# Altium project PCB_Project.PrjPcb
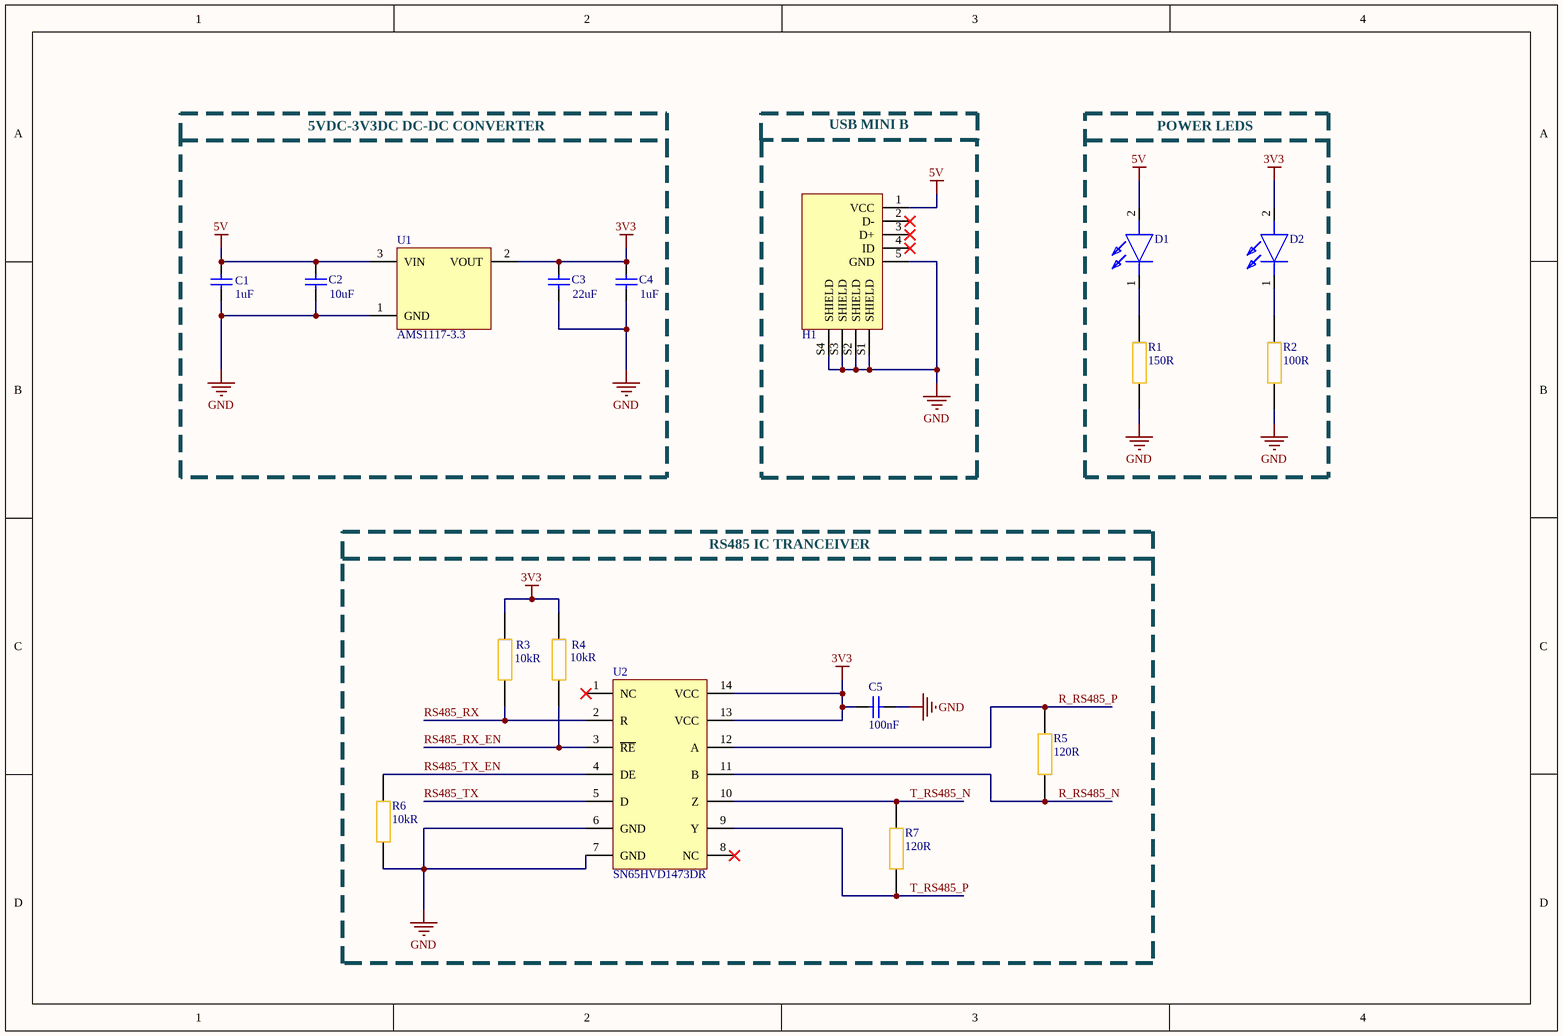
[diagram p0: PowerManagement.SchDoc]
3 sheets, 46 parts. Net scope: global (net labels, ports and power ports of the same name join across sheets).
Board file: PCB_STM.PcbDoc
Sheets:
  PowerManagement.SchDoc
  Microcontroller.SchDoc
  Connectors.SchDoc

## Sheet PowerManagement.SchDoc
size A4; SheetNumber: 1; SheetTotal: 3

### Parts
C1  1uF  [WCAP-CSGP_0603_L1.6W0.8H0.8_Reflow]
C2  10uF  [WCAP-CSGP_0603_L1.6W0.8H0.8_Reflow]
C3  22uF  [WCAP-CSGP_0805_L2W1.25H1.25]
C4  1uF  [WCAP-CSGP_0603_L1.6W0.8H0.8_Reflow]
C5  100nF  [WCAP-CSGP_0603_L1.6W0.8H0.8_Reflow]
D1  APT1608SGC  [LED GREEN]  (value not drawn)
D2  APT1608SGC  [LED GREEN]  (value not drawn)
H1  690-005-299-043  [USB]  (value not drawn)
R1  Resistance: 150R  [RES 0603]  (hidden comment: RC0603FR-07150RL)
R2  Resistance: 100R  [RES 0603]  (hidden comment: RC0603FR-13100RL)
R3  Resistance: 10kR  [RES 0603]  (hidden comment: RC0603FR-0710KP)
R4  Resistance: 10kR  [RES 0603]  (hidden comment: RC0603FR-0710KP)
R5  Resistance: 120R  [RES 0603]  (hidden comment: RC0603FR-07120RL)
R6  Resistance: 10kR  [RES 0603]  (hidden comment: RC0603FR-0710KP)
R7  Resistance: 120R  [RES 0603]  (hidden comment: RC0603FR-07120RL)
U1  AMS1117-3.3  [SOT-223]
U2  SN65HVD1473DR  [14-SOIC]

### Blocks framed on the sheet
5VDC-3V3DC DC-DC CONVERTER: C1-C4 U1
USB MINI B: H1
RS485 IC TRANCEIVER: C5 R3-R7 U2

### Nets
3V3: C3.2 C4.2 C5.2 D2.2(A) R3.2 R4.2 U1.2(VOUT) U2.13(VCC) U2.14(VCC)
5V: C1.2 C2.2 D1.2(A) H1.1(VCC) U1.3(VIN)
GND: C1.1 C2.1 C3.1 C4.1 C5.1 H1.5(GND) H1.S1(SHIELD) H1.S2(SHIELD) H1.S3(SHIELD) H1.S4(SHIELD) R1.1 R2.1 R6.2 U1.1(GND) U2.6(GND) U2.7(GND)
R_RS485_N: R5.2 U2.11(B)
R_RS485_P: R5.1 U2.12(A)
RS485_RX: R3.1 U2.2(R)
RS485_RX_EN: R4.1 U2.3(~{RE})
RS485_TX: U2.5(D)
RS485_TX_EN: R6.1 U2.4(DE)
T_RS485_N: R7.2 U2.10(Z)
T_RS485_P: R7.1 U2.9(Y)
NetD1_1: D1.1(K) R1.2
NetD2_1: D2.1(K) R2.2

Not connected (* = marked no-connect by the designer): H1 2(D-)* 3(D+)* 4(ID)*; U2 1(NC)* 8(NC)*

### Notes on the sheet
- POWER LEDS

### Library data of the parts
C1 C4 = 885012106010: WCAP-CSGP Multilayer Ceramic Chip Capacitor, General Purpose, size 0603, X5R, 1µF, 10VDC; Manufacturer: Wurth Elektronik; Case/Size Code: 0603; Capacitance Tolerance: +/-20%; Dissipation Factor: 10%; Insulation Resistance: 0.1GOhm; Rated Voltage (DC): 10V; Technical Reference: X5R0603105M010DFCT10000; Manufacturer Part Number: 885012106010; Category: Multilayer Ceramic Chip Capacitors; Match Code: WCAP-CSGP; ComponentLink1Description: Website Link; ComponentLink1URL: https://www.we-online.com/redexpert/article/885012106010?ad; ComponentLink2Description: Datasheet Link; ComponentLink2URL: https://www.we-online.com/redexpert/spec/885012106010?ad; Mount: Surface Mount; Operating Temperature Max: 85°C; Operating Temperature Min: -55°C; Packaging: Tape and Reel; Length: 1.6mm; Width: 0.8mm; Height: 0.8mm; Capacitance: 1uF; Ceramic Type: X5R
C2 = 885012106031: WCAP-CSGP Multilayer Ceramic Chip Capacitor, General Purpose, size 0603, X5R, 10µF, 25VDC; Manufacturer: Wurth Elektronik; Case/Size Code: 0603; Capacitance Tolerance: +/20%; Dissipation Factor: 20%; Insulation Resistance: 0.01GOhm; Rated Voltage (DC): 25V; Technical Reference: X5R0603106M025DFCT10000; Manufacturer Part Number: 885012106031; Category: Multilayer Ceramic Chip Capacitors; Match Code: WCAP-CSGP; ComponentLink1Description: Website Link; ComponentLink1URL: https://www.we-online.com/redexpert/article/885012106031?ad; ComponentLink2Description: Datasheet Link; ComponentLink2URL: https://www.we-online.com/redexpert/spec/885012106031?ad; Mount: Surface Mount; Operating Temperature Max: 85°C; Operating Temperature Min: -55°C; Packaging: Tape and Reel; Length: 1.6mm; Width: 0.8mm; Height: 0.8mm; Capacitance: 10uF; Ceramic Type: X5R
C3 = 885012107011: WCAP-CSGP Multilayer Ceramic Chip Capacitor, General Purpose, size 0805, X5R, 22µF, 10VDC; Manufacturer: Wurth Elektronik; Case/Size Code: 0805; Capacitance Tolerance: +/-20%; Dissipation Factor: 10%; Insulation Resistance: 0.005GOhm; Rated Voltage (DC): 10V; Technical Reference: X5R0805226M010DFCT10000; Manufacturer Part Number: 885012107011; Category: Multilayer Ceramic Chip Capacitors; Match Code: WCAP-CSGP; ComponentLink1Description: Website Link; ComponentLink1URL: https://www.we-online.com/redexpert/article/885012107011?ad; ComponentLink2Description: Datasheet Link; ComponentLink2URL: https://www.we-online.com/redexpert/spec/885012107011?ad; Mount: Surface Mount; Operating Temperature Max: 85°C; Operating Temperature Min: -55°C; Packaging: Tape and Reel; Length: 2mm; Width: 1.25mm; Height: 1.25mm; Capacitance: 22uF; Ceramic Type: X5R
C5 = 885012206046: WCAP-CSGP Multilayer Ceramic Chip Capacitor, General Purpose, size 0603, X7R, 100nF, 16VDC; Manufacturer: Wurth Elektronik; Case/Size Code: 0603; Capacitance Tolerance: +/-10%; Dissipation Factor: 3.5%; Insulation Resistance: 5GOhm; Rated Voltage (DC): 16V; Technical Reference: X7R0603104K016DFCT10000; Manufacturer Part Number: 885012206046; Category: Multilayer Ceramic Chip Capacitors; Match Code: WCAP-CSGP; ComponentLink1Description: Website Link; ComponentLink1URL: https://www.we-online.com/redexpert/article/885012206046?ad; ComponentLink2Description: Datasheet Link; ComponentLink2URL: https://www.we-online.com/redexpert/spec/885012206046?ad; Mount: Surface Mount; Operating Temperature Max: 125°C; Operating Temperature Min: -55°C; Packaging: Tape and Reel; Length: 1.6mm; Width: 0.8mm; Height: 0.8mm; Capacitance: 100nF; Ceramic Type: X7R
D1 D2 = APT1608SGC: LED GREEN CLEAR 0603 SMD; Manufacturer: Kingbright; Forward Voltage: 2.2V; Viewing Angle: 120°; Forward Current: 20mA; Luminous Intensity: 15mcd; Lens Style: Clear,Flat; Dominant Wavelength: 568nm; Number of LEDs: 1; Designed by: ADAK; Supplier 1: Digi-Key; Manufacturer Part Number: APT1608SGC; RoHS: Yes; Category: LEDs; Stock 1: 356278; Pricing 1: 1=0,3, 10=0,237, 100=0,1064, 500=0,0961, 1000=0,07894 (USD); Mount: Surface Mount; Case/Package: 0603; Number of Pins: 2; Color: Green; Case Code (Metric): 1608; Case Code (Imperial): 0603; Lens Color: Clear; Min Operating Temperature: -40°C; Max Operating Temperature: 85°C; Package Quantity: 2000; Illumination Color: Green; Packaging: Tape and Reel; Test Current: 20mA; Wavelength: 568nm; Series: APT; Length: 1.6mm; Width: 0.8mm; Height: 0.75mm; Lead Free: Lead Free; RoHS Compliant: Yes; ComponentLink1URL: https://datasheet.ciiva.com/12400/apt1608sgc-32861-12400932.pdf?src-supplier=Mouser; ComponentLink1Description: https://datasheet.ciiva.com/12400/apt1608sgc-32861-12400932.pdf?src-supplier=Mouser; ComponentLink2URL: https://datasheet.ciiva.com/2113/apt1608sgc-2113808.pdf?src-supplier=Digi-Key; ComponentLink2Description: https://datasheet.ciiva.com/2113/apt1608sgc-2113808.pdf?src-supplier=Digi-Key; ComponentLink3URL: https://datasheet.ciiva.com/14603/70062839-14603927.pdf?src-supplier=Allied+Electronics; ComponentLink3Description: https://datasheet.ciiva.com/14603/70062839-14603927.pdf?src-supplier=Allied+Electronics; Supplier Part Number 1: 754-1121-1-ND
H1 = USB Mini B: CONN RCPT USB2.0 MINI B SMD R/A; Manufacturer: EDAC; Number of Contacts: 5; Gender: Receptacle; Number of Ports: 1; Mating Cycles: 1500; Shielding: Unshielded; Pitch: 0.8mm; Designed by: ADAK; Supplier 1: Digi-Key; Manufacturer Part Number: 690-005-299-043; RoHS: No; Category: USB Connectors; Stock 1: 72958; Pricing 1: 1=0,65, 10=0,564, 25=0,5152, 50=0,4848, 100=0,4646, 250=0,4242, 500=0,404 (USD); Mount: Surface Mount,Horizontal; Color: Black; Contact Material: Bronze; Contact Plating: Gold; Housing Material: Thermoplastic; Insulation Color: Black; Min Operating Temperature: -30°C; Max Operating Temperature: 80°C; Packaging: Cut Tape; Connector Type: USB; Termination: Solder; Orientation: Right Angle; Series: 690; Lead Free: Lead Free; Flammability Rating: UL94 V-0; ComponentLink1URL: https://datasheet.ciiva.com/30246/690-005-299-043-30246515.pdf?src-supplier=Onlinecomponents.com; ComponentLink1Description: https://datasheet.ciiva.com/30246/690-005-299-043-30246515.pdf?src-supplier=Onlinecomponents.com; ComponentLink2URL: https://datasheet.ciiva.com/29660/690-005-299-043-29660027.pdf?src-supplier=Digi-Key; ComponentLink2Description: https://datasheet.ciiva.com/29660/690-005-299-043-29660027.pdf?src-supplier=Digi-Key; ComponentLink3URL: https://datasheet.ciiva.com/29660/690-005-299-043-29660028.pdf?src-supplier=Digi-Key; ComponentLink3Description: https://datasheet.ciiva.com/29660/690-005-299-043-29660028.pdf?src-supplier=Digi-Key; ComponentLink4URL: https://datasheet.ciiva.com/29660/690-005-299-043-29660029.pdf?src-supplier=Digi-Key; ComponentLink4Description: https://datasheet.ciiva.com/29660/690-005-299-043-29660029.pdf?src-supplier=Digi-Key; Supplier Part Number 1: 151-1206-1-ND
R1 = RES 150 OHM 0603: RES 150 OHM 1% 1/10W 0603 SMD; Manufacturer: Yageo; Power Rating: 100mW; Voltage Rating: 50V; Temperature Coefficient: 100ppm/°C; Designed by: ADAK; Supplier 1: Digi-Key; Manufacturer Part Number: RC0603FR-07150RL; RoHS: Yes; Category: Chip SMD Resistors; Stock 1: 1463209; Pricing 1: 1=0,1, 10=0,018, 50=0,0106, 100=0,0088, 500=0,00592, 1000=0,00505 (USD); Case/Package: 0603; Number of Pins: 2; Case Code (Imperial): 0603; Case Code (Metric): 1608; Size Code: 0603; Min Operating Temperature: -55°C; Max Operating Temperature: 155°C; Tolerance: 1%; Voltage Rating (DC): 50V; Packaging: Tape and Reel; Package Quantity: 5000; Termination: SMD/SMT; Resistor Type: Thick Film; Features: Moisture Resistant; Series: RC; Max Power Dissipation: 100mW; Number of Terminations: 2; Resistance Tolerance: 1%; Length: 1.6mm; Width: 0.8mm; Height: 0.45mm; Reach SVHC Compliant: No; Lead Free: Lead Free; RoHS Compliant: Yes; ComponentLink1URL: https://datasheet.ciiva.com/46412/443971-46412844.pdf?src-supplier=Element14; ComponentLink1Description: https://datasheet.ciiva.com/46412/443971-46412844.pdf?src-supplier=Element14; ComponentLink2URL: https://datasheet.ciiva.com/46440/1868787-46440893.pdf?src-supplier=Element14; ComponentLink2Description: https://datasheet.ciiva.com/46440/1868787-46440893.pdf?src-supplier=Element14; ComponentLink3URL: https://datasheet.ciiva.com/12555/rc0603-272842-12555301.pdf?src-supplier=Mouser; ComponentLink3Description: https://datasheet.ciiva.com/12555/rc0603-272842-12555301.pdf?src-supplier=Mouser; Supplier Part Number 1: 311-150HRCT-ND
R2 = RES 100 OHM 0603: RES 100 OHM 1% 1/10W 0603 SMD; Manufacturer: Yageo; Power Rating: 100mW; Voltage Rating: 50V; Temperature Coefficient: 100ppm/°C; Designed by: ADAK; Supplier 1: Digi-Key; Manufacturer Part Number: RC0603FR-13100RL; RoHS: Yes; Category: Chip SMD Resistors; Stock 1: 77195; Pricing 1: 1=0,1, 10=0,018, 50=0,0106, 100=0,0088, 500=0,00592, 1000=0,00505, 5000=0,00363, 10000=0,00318 (USD); Case/Package: 0603; Number of Pins: 2; Case Code (Imperial): 0603; Case Code (Metric): 1608; Size Code: 0603; Min Operating Temperature: -55°C; Max Operating Temperature: 155°C; Tolerance: 1%; Packaging: Tape and Reel; Termination: SMD/SMT; Resistor Type: Thick Film; Voltage Rating (DC): 50V; Series: RC; Resistance Tolerance: 1%; Length: 1.6mm; Width: 0.8mm; Height: 0.45mm; Reach SVHC Compliant: No; Lead Free: Lead Free; RoHS Compliant: Yes; ComponentLink1URL: https://datasheet.ciiva.com/7983/443971-7983671.pdf?src-supplier=Element14; ComponentLink1Description: https://datasheet.ciiva.com/7983/443971-7983671.pdf?src-supplier=Element14; ComponentLink2URL: https://datasheet.ciiva.com/12561/rc0603-272842-12561884.pdf?src-supplier=Mouser; ComponentLink2Description: https://datasheet.ciiva.com/12561/rc0603-272842-12561884.pdf?src-supplier=Mouser; Supplier Part Number 1: 13-RC0603FR-13100RLCT-ND
R3 R4 R6 = RES 10K OHM 0603: RES 10K OHM 1% 1/10W 0603 SMD; Manufacturer: Yageo; Max Power Dissipation: 100mW; Temperature Coefficient: 150ppm/°C; Designed by: ADAK; Supplier 1: Digi-Key; Manufacturer Part Number: RC0603FR-0710KP; RoHS: Yes; Category: Chip SMD Resistors; Stock 1: 239190; Pricing 1: 1=0,1, 10=0,024, 50=0,0154, 100=0,0129, 500=0,00892, 1000=0,0077 (USD); Case/Package: 0603; Case Code (Metric): 1608; Case Code (Imperial): 0603; Min Operating Temperature: -55°C; Max Operating Temperature: 155°C; Packaging: Cut Tape; Number of Terminations: 2; Tolerance: 1%; Features: Moisture Resistant; Series: RC-P Lead Free; Length: 0.063inch; Width: 0.031inch; Height: 0.022inch; RoHS Compliant: Yes; ComponentLink1URL: https://www.mouser.com/ds/2/447/yageodocoutput-1115409.pdf?src-supplier=Mouser; ComponentLink1Description: https://www.mouser.com/ds/2/447/yageodocoutput-1115409.pdf?src-supplier=Mouser; ComponentLink2URL: http://www.yageo.com/NewPortal/yageodocoutput?fileName=/pdf/R-Chip/PYu-RC_51_RoHS_P_0.pdf&src-supplier=Digi-Key; ComponentLink2Description: http://www.yageo.com/NewPortal/yageodocoutput?fileName=/pdf/R-Chip/PYu-RC_51_RoHS_P_0.pdf&src-supplier=Digi-Key; ComponentLink3URL: http://www.yageo.com.tw/exep/pages/download/literatures/PYu-R_INT-thick_7.pdf?src-supplier=Digi-Key; ComponentLink3Description: http://www.yageo.com.tw/exep/pages/download/literatures/PYu-R_INT-thick_7.pdf?src-supplier=Digi-Key; Supplier Part Number 1: YAG1290CT-ND
R5 R7 = RES 120 OHM 0603: RES 120 OHM 1% 1/10W 0603 SMD; Manufacturer: Yageo; Voltage Rating (DC): 50V; Temperature Coefficient: 100ppm/°C; Power Rating: 100mW; Designed by: ADAK; Supplier 1: Digi-Key; Manufacturer Part Number: RC0603FR-07120RL; RoHS: Yes; Category: Chip SMD Resistors; Stock 1: 665150; Pricing 1: 1=0,1, 10=0,018, 50=0,0106, 100=0,0088, 500=0,00592, 1000=0,00505 (USD); Case/Package: 0603; Number of Pins: 2; Case Code (Metric): 1608; Case Code (Imperial): 0603; Size Code: 0603; Min Operating Temperature: -55°C; Max Operating Temperature: 155°C; Tolerance: 1%; Packaging: Tape and Reel; Resistor Type: Thick Film; Voltage Rating: 50V; Package Quantity: 1; Number of Terminations: 2; Termination: SMD/SMT; Max Power Dissipation: 100mW; Features: Moisture Resistant; Series: RC; Construction: Rectangular; Resistance Tolerance: 1%; Length: 0.063inch; Width: 0.031inch; Height: 0.022inch; Depth: 0.8mm; Reach SVHC Compliant: No; Lead Free: Lead Free; Military Standard: Not; RoHS Compliant: Yes; ComponentLink1URL: https://datasheet.ciiva.com/46395/443971-46395021.pdf?src-supplier=Element14; ComponentLink1Description: https://datasheet.ciiva.com/46395/443971-46395021.pdf?src-supplier=Element14; ComponentLink2URL: https://datasheet.ciiva.com/2553/pyu-r-int-thick-7-2553513.pdf?src-supplier=Digi-Key; ComponentLink2Description: https://datasheet.ciiva.com/2553/pyu-r-int-thick-7-2553513.pdf?src-supplier=Digi-Key; ComponentLink3URL: https://datasheet.ciiva.com/2553/pyu-r-int-thick-7-2553514.pdf?src-supplier=Digi-Key; ComponentLink3Description: https://datasheet.ciiva.com/2553/pyu-r-int-thick-7-2553514.pdf?src-supplier=Digi-Key; ComponentLink4URL: https://datasheet.ciiva.com/2553/pyu-r-int-thick-7-2553512.pdf?src-supplier=Digi-Key; ComponentLink4Description: https://datasheet.ciiva.com/2553/pyu-r-int-thick-7-2553512.pdf?src-supplier=Digi-Key; ComponentLink5URL: https://datasheet.ciiva.com/7746/443971-7746249.pdf?src-supplier=Element14; ComponentLink5Description: https://datasheet.ciiva.com/7746/443971-7746249.pdf?src-supplier=Element14; ComponentLink6URL: https://datasheet.ciiva.com/7746/443971-7746248.pdf?src-supplier=Element14; ComponentLink6Description: https://datasheet.ciiva.com/7746/443971-7746248.pdf?src-supplier=Element14; Supplier Part Number 1: 311-120HRCT-ND
U1 = AMS1117-3.3: Low Dropout Voltage Regulatator SOT-223 1A 3.3V; Designed by: ADAK; Package: SOT-223; Voltage-Ouptut(Fixed): 3.3V; Current: 1A
U2 = SN65HVD1473DR: IC TRANSCEIVER FULL 1/1 14SOIC; Manufacturer: Texas Instruments; Designed by: ADAK; Supplier 1: Digi-Key; Manufacturer Part Number: SN65HVD1473DR; RoHS: Yes; Category: Interface ICs; Stock 1: 2430; Pricing 1: 1=4,39, 10=3,94, 25=3,7248, 100=3,228, 250=3,06248, 500=2,74794, 1000=2,31755 (USD); ComponentLink1URL: http://www.ti.com/general/docs/suppproductinfo.tsp?distId=10&amp;gotoUrl=http%3A%2F%2Fwww.ti.com%2Flit%2Fgpn%2Fsn65hvd1473&src-supplier=Digi-Key; ComponentLink1Description: http://www.ti.com/general/docs/suppproductinfo.tsp?distId=10&amp;gotoUrl=http%3A%2F%2Fwww.ti.com%2Flit%2Fgpn%2Fsn65hvd1473&src-supplier=Digi-Key; ComponentLink2URL: http://www.ti.com/lit/ds/symlink/sn65hvd1473.pdf?src-supplier=Digi-Key; ComponentLink2Description: http://www.ti.com/lit/ds/symlink/sn65hvd1473.pdf?src-supplier=Digi-Key; ComponentLink3URL: http://www.ti.com/general/docs/lit/getliterature.tsp?genericPartNumber=SN65HVD1477&&fileType=pdf&src-supplier=Avnet; ComponentLink3Description: http://www.ti.com/general/docs/lit/getliterature.tsp?genericPartNumber=SN65HVD1477&&fileType=pdf&src-supplier=Avnet; Supplier Part Number 1: 296-40505-1-ND

## Sheet Microcontroller.SchDoc
size A4; SheetNumber: 2; SheetTotal: 3
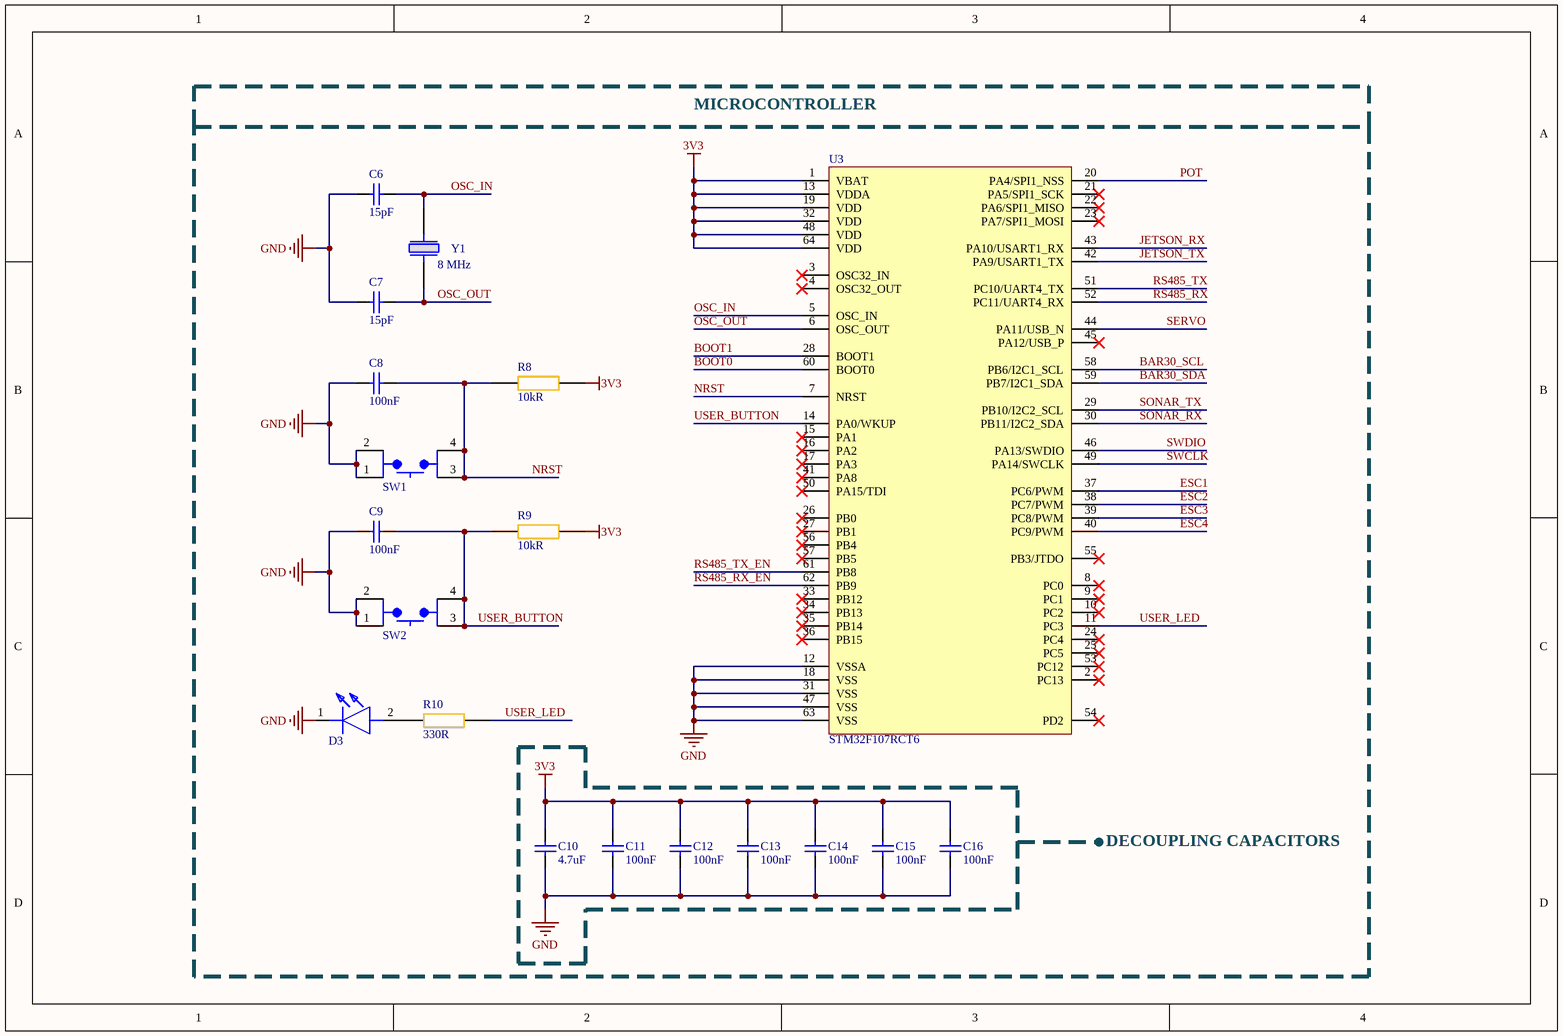
[diagram p1: Microcontroller.SchDoc]

### Parts
C6  15pF  [WCAP-CSGP_0603_L1.6W0.8H0.8_Reflow]
C7  15pF  [WCAP-CSGP_0603_L1.6W0.8H0.8_Reflow]
C8  100nF  [WCAP-CSGP_0603_L1.6W0.8H0.8_Reflow]
C9  100nF  [WCAP-CSGP_0603_L1.6W0.8H0.8_Reflow]
C10  4.7uF  [WCAP-CSGP_0805_L2W1.25H1.25]
C11  100nF  [WCAP-CSGP_0603_L1.6W0.8H0.8_Reflow]
C12  100nF  [WCAP-CSGP_0603_L1.6W0.8H0.8_Reflow]
C13  100nF  [WCAP-CSGP_0603_L1.6W0.8H0.8_Reflow]
C14  100nF  [WCAP-CSGP_0603_L1.6W0.8H0.8_Reflow]
C15  100nF  [WCAP-CSGP_0603_L1.6W0.8H0.8_Reflow]
C16  100nF  [WCAP-CSGP_0603_L1.6W0.8H0.8_Reflow]
D3  APT1608SGC  [LED GREEN]  (value not drawn)
R8  Resistance: 10kR  [RES 0603]  (hidden comment: RC0603FR-0710KP)
R9  Resistance: 10kR  [RES 0603]  (hidden comment: RC0603FR-0710KP)
R10  Resistance: 330R  [RES 0603]  (hidden comment: RC0603FR-07330RL)
SW1  TL3305AF260QG  [RESET BUTTON]  (value not drawn)
SW2  TL3305AF260QG  [RESET BUTTON]  (value not drawn)
U3  STM32F107RCT6  [STM32F107RCT6]
Y1  Frequency: 8 MHz  [OSC]  (hidden comment: ECS-80-20-5PXDU-TR)

### Nets
3V3: C10.2 C11.2 C12.2 C13.2 C14.2 C15.2 C16.2 R8.1 R9.1 U3.1(VBAT) U3.13(VDDA) U3.19(VDD) U3.32(VDD) U3.48(VDD) U3.64(VDD)
GND: C6.1 C7.1 C8.2 C9.2 C10.1 C11.1 C12.1 C13.1 C14.1 C15.1 C16.1 D3.1(K) SW1.1 SW1.2 SW2.1 SW2.2 U3.12(VSSA) U3.18(VSS) U3.31(VSS) U3.47(VSS) U3.63(VSS)
BAR30_SCL: U3.58(PB6/I2C1_SCL)
BAR30_SDA: U3.59(PB7/I2C1_SDA)
BOOT0: U3.60(BOOT0)
BOOT1: U3.28(BOOT1)
ESC1: U3.37(PC6/PWM)
ESC2: U3.38(PC7/PWM)
ESC3: U3.39(PC8/PWM)
ESC4: U3.40(PC9/PWM)
JETSON_RX: U3.43(PA10/USART1_RX)
JETSON_TX: U3.42(PA9/USART1_TX)
NRST: C8.1 R8.2 SW1.3 SW1.4 U3.7(NRST)
OSC_IN: C6.2 U3.5(OSC_IN) Y1.1
OSC_OUT: C7.2 U3.6(OSC_OUT) Y1.2
POT: U3.20(PA4/SPI1_NSS)
RS485_RX: U3.52(PC11/UART4_RX)
RS485_RX_EN: U3.62(PB9)
RS485_TX: U3.51(PC10/UART4_TX)
RS485_TX_EN: U3.61(PB8)
SERVO: U3.44(PA11/USB_N)
SONAR_RX: U3.30(PB11/I2C2_SDA)
SONAR_TX: U3.29(PB10/I2C2_SCL)
SWCLK: U3.49(PA14/SWCLK)
SWDIO: U3.46(PA13/SWDIO)
USER_BUTTON: C9.1 R9.2 SW2.3 SW2.4 U3.14(PA0/WKUP)
USER_LED: R10.2 U3.11(PC3)
NetD3_2: D3.2(A) R10.1

Not connected (* = marked no-connect by the designer): U3 2(PC13)* 3(OSC32_IN)* 4(OSC32_OUT)* 8(PC0)* 9(PC1)* 10(PC2)* 15(PA1)* 16(PA2)* 17(PA3)* 21(PA5/SPI1_SCK)* 22(PA6/SPI1_MISO)* 23(PA7/SPI1_MOSI)* 24(PC4)* 25(PC5)* 26(PB0)* 27(PB1)* 33(PB12)* 34(PB13)* 35(PB14)* 36(PB15)* 41(PA8)* 45(PA12/USB_P)* 50(PA15/TDI)* 53(PC12)* 54(PD2)* 55(PB3/JTDO)* 56(PB4)* 57(PB5)*

### Notes on the sheet
- MICROCONTROLLER
- DECOUPLING CAPACITORS

### Library data of the parts
C6 C7 = 885012006018: WCAP-CSGP Multilayer Ceramic Chip Capacitor, General Purpose, size 0603, NP0, 15pF, 16VDC; Manufacturer: Wurth Elektronik; Case/Size Code: 0603; Capacitance Tolerance: +/-5%; Insulation Resistance: 10GOhm; Q Factor: 700; Rated Voltage (DC): 16V; Technical Reference: NP00603150J016DFCT10000; Manufacturer Part Number: 885012006018; Category: Multilayer Ceramic Chip Capacitors; Match Code: WCAP-CSGP; ComponentLink1Description: Website Link; ComponentLink1URL: https://www.we-online.com/redexpert/article/885012006018?ad; ComponentLink2Description: Datasheet Link; ComponentLink2URL: https://www.we-online.com/redexpert/spec/885012006018?ad; Mount: Surface Mount; Operating Temperature Max: 125°C; Operating Temperature Min: -55°C; Packaging: Tape and Reel; Length: 1.6mm; Width: 0.8mm; Height: 0.8mm; Capacitance: 15pF; Ceramic Type: NP0
C8 C9 = 885012206020: WCAP-CSGP Multilayer Ceramic Chip Capacitor, General Purpose, size 0603, X7R, 100nF, 10VDC; Manufacturer: Wurth Elektronik; Case/Size Code: 0603; Capacitance Tolerance: +/-10%; Dissipation Factor: 5%; Insulation Resistance: 5GOhm; Rated Voltage (DC): 10V; Technical Reference: X7R0603104K010DFCT10000; Manufacturer Part Number: 885012206020; Category: Multilayer Ceramic Chip Capacitors; Match Code: WCAP-CSGP; ComponentLink1Description: Website Link; ComponentLink1URL: https://www.we-online.com/redexpert/article/885012206020?ad; ComponentLink2Description: Datasheet Link; ComponentLink2URL: https://www.we-online.com/redexpert/spec/885012206020?ad; Mount: Surface Mount; Operating Temperature Max: 125°C; Operating Temperature Min: -55°C; Packaging: Tape and Reel; Length: 1.6mm; Width: 0.8mm; Height: 0.8mm; Capacitance: 100nF; Ceramic Type: X7R
C10 = 885012207053: WCAP-CSGP Multilayer Ceramic Chip Capacitor, General Purpose, size 0805, X7R, 4.7µF, 16VDC; Manufacturer: Wurth Elektronik; Case/Size Code: 0805; Capacitance Tolerance: +/-10%; Dissipation Factor: 10%; Insulation Resistance: 0.02GOhm; Rated Voltage (DC): 16V; Technical Reference: X7R0805475K016DFCT10000; Manufacturer Part Number: 885012207053; Category: Multilayer Ceramic Chip Capacitors; Match Code: WCAP-CSGP; ComponentLink1Description: Website Link; ComponentLink1URL: https://www.we-online.com/redexpert/article/885012207053?ad; ComponentLink2Description: Datasheet Link; ComponentLink2URL: https://www.we-online.com/redexpert/spec/885012207053?ad; Mount: Surface Mount; Operating Temperature Max: 125°C; Operating Temperature Min: -55°C; Packaging: Tape and Reel; Length: 2mm; Width: 1.25mm; Height: 1.25mm; Capacitance: 4.7uF; Ceramic Type: X7R
C11-C16 = 885012206046: as C5 on sheet PowerManagement; Manufacturer Part Number: 885012206046; Category: Multilayer Ceramic Chip Capacitors; Match Code: WCAP-CSGP; ComponentLink1Description: Website Link; ComponentLink1URL: https://www.we-online.com/redexpert/article/885012206046?ad; ComponentLink2Description: Datasheet Link; ComponentLink2URL: https://www.we-online.com/redexpert/spec/885012206046?ad; Mount: Surface Mount; Operating Temperature Max: 125°C; Operating Temperature Min: -55°C; Packaging: Tape and Reel; Length: 1.6mm; Width: 0.8mm; Height: 0.8mm; Capacitance: 100nF; Ceramic Type: X7R
D3 = APT1608SGC: as D1 on sheet PowerManagement; Supplier 1: Digi-Key; Manufacturer Part Number: APT1608SGC; RoHS: Yes; Category: LEDs; Stock 1: 356278; Pricing 1: 1=0,3, 10=0,237, 100=0,1064, 500=0,0961, 1000=0,07894 (USD); Mount: Surface Mount; Case/Package: 0603; Number of Pins: 2; Color: Green; Case Code (Metric): 1608; Case Code (Imperial): 0603; Lens Color: Clear; Min Operating Temperature: -40°C; Max Operating Temperature: 85°C; Package Quantity: 2000; Illumination Color: Green; Packaging: Tape and Reel; Test Current: 20mA; Wavelength: 568nm; Series: APT; Length: 1.6mm; Width: 0.8mm; Height: 0.75mm; Lead Free: Lead Free; RoHS Compliant: Yes; ComponentLink1URL: https://datasheet.ciiva.com/12400/apt1608sgc-32861-12400932.pdf?src-supplier=Mouser; ComponentLink1Description: https://datasheet.ciiva.com/12400/apt1608sgc-32861-12400932.pdf?src-supplier=Mouser; ComponentLink2URL: https://datasheet.ciiva.com/2113/apt1608sgc-2113808.pdf?src-supplier=Digi-Key; ComponentLink2Description: https://datasheet.ciiva.com/2113/apt1608sgc-2113808.pdf?src-supplier=Digi-Key; ComponentLink3URL: https://datasheet.ciiva.com/14603/70062839-14603927.pdf?src-supplier=Allied+Electronics; ComponentLink3Description: https://datasheet.ciiva.com/14603/70062839-14603927.pdf?src-supplier=Allied+Electronics; Supplier Part Number 1: 754-1121-1-ND
R8 R9 = RES 10K OHM 0603: as R3 on sheet PowerManagement; Supplier 1: Digi-Key; Manufacturer Part Number: RC0603FR-0710KP; RoHS: Yes; Category: Chip SMD Resistors; Stock 1: 239190; Pricing 1: 1=0,1, 10=0,024, 50=0,0154, 100=0,0129, 500=0,00892, 1000=0,0077 (USD); Case/Package: 0603; Case Code (Metric): 1608; Case Code (Imperial): 0603; Min Operating Temperature: -55°C; Max Operating Temperature: 155°C; Packaging: Cut Tape; Number of Terminations: 2; Tolerance: 1%; Features: Moisture Resistant; Series: RC-P Lead Free; Length: 0.063inch; Width: 0.031inch; Height: 0.022inch; RoHS Compliant: Yes; ComponentLink1URL: https://www.mouser.com/ds/2/447/yageodocoutput-1115409.pdf?src-supplier=Mouser; ComponentLink1Description: https://www.mouser.com/ds/2/447/yageodocoutput-1115409.pdf?src-supplier=Mouser; ComponentLink2URL: http://www.yageo.com/NewPortal/yageodocoutput?fileName=/pdf/R-Chip/PYu-RC_51_RoHS_P_0.pdf&src-supplier=Digi-Key; ComponentLink2Description: http://www.yageo.com/NewPortal/yageodocoutput?fileName=/pdf/R-Chip/PYu-RC_51_RoHS_P_0.pdf&src-supplier=Digi-Key; ComponentLink3URL: http://www.yageo.com.tw/exep/pages/download/literatures/PYu-R_INT-thick_7.pdf?src-supplier=Digi-Key; ComponentLink3Description: http://www.yageo.com.tw/exep/pages/download/literatures/PYu-R_INT-thick_7.pdf?src-supplier=Digi-Key; Supplier Part Number 1: YAG1290CT-ND
R10 = RES 330 OHM 0603: RES 330 OHM 1% 1/10W 0603 SMD; Manufacturer: Yageo; Voltage Rating (DC): 50V; Power Rating: 100mW; Temperature Coefficient: 100ppm/°C; Designed by: ADAK; Supplier 1: Digi-Key; Manufacturer Part Number: RC0603FR-07330RL; RoHS: Yes; Category: Chip SMD Resistors; Stock 1: 1275960; Pricing 1: 1=0,1, 10=0,018, 50=0,0106, 100=0,0088, 500=0,00592, 1000=0,00505 (USD); Case/Package: 0603; Number of Pins: 2; Case Code (Metric): 1608; Case Code (Imperial): 0603; Size Code: 0603; Min Operating Temperature: -55°C; Max Operating Temperature: 155°C; Tolerance: 1%; Resistor Type: Thick Film; Packaging: Tape and Reel; Voltage Rating: 50V; Package Quantity: 1; Number of Terminations: 2; Termination: SMD/SMT; Max Power Dissipation: 100mW; Features: Moisture Resistant; Series: RC; Resistance Tolerance: 1%; Technology: THICK FILM; Length: 1.6mm; Width: 0.8mm; Height: 0.45mm; Depth: 0.8mm; Reach SVHC Compliant: No; Lead Free: Lead Free; RoHS Compliant: Yes; ComponentLink1URL: https://datasheet.ciiva.com/11819/0900766b80f96399-11819327.pdf?src-supplier=Rs; ComponentLink1Description: https://datasheet.ciiva.com/11819/0900766b80f96399-11819327.pdf?src-supplier=Rs; ComponentLink2URL: https://datasheet.ciiva.com/7746/1686128-7746331.pdf?src-supplier=Element14; ComponentLink2Description: https://datasheet.ciiva.com/7746/1686128-7746331.pdf?src-supplier=Element14; ComponentLink3URL: https://datasheet.ciiva.com/46440/1868787-46440904.pdf?src-supplier=Element14; ComponentLink3Description: https://datasheet.ciiva.com/46440/1868787-46440904.pdf?src-supplier=Element14; ComponentLink4URL: https://datasheet.ciiva.com/2454/pyu-r-int-thick-7-2454865.pdf?src-supplier=Digi-Key; ComponentLink4Description: https://datasheet.ciiva.com/2454/pyu-r-int-thick-7-2454865.pdf?src-supplier=Digi-Key; ComponentLink5URL: https://datasheet.ciiva.com/2454/pyu-r-int-thick-7-2454866.pdf?src-supplier=Digi-Key; ComponentLink5Description: https://datasheet.ciiva.com/2454/pyu-r-int-thick-7-2454866.pdf?src-supplier=Digi-Key; ComponentLink6URL: https://datasheet.ciiva.com/2454/pyu-r-int-thick-7-2454864.pdf?src-supplier=Digi-Key; ComponentLink6Description: https://datasheet.ciiva.com/2454/pyu-r-int-thick-7-2454864.pdf?src-supplier=Digi-Key; ComponentLink7URL: https://datasheet.ciiva.com/12555/rc0603-272842-12555334.pdf?src-supplier=Mouser; ComponentLink7Description: https://datasheet.ciiva.com/12555/rc0603-272842-12555334.pdf?src-supplier=Mouser; ComponentLink8URL: https://datasheet.ciiva.com/7746/443971-7746329.pdf?src-supplier=Element14; ComponentLink8Description: https://datasheet.ciiva.com/7746/443971-7746329.pdf?src-supplier=Element14; ComponentLink9URL: https://datasheet.ciiva.com/7746/443971-7746330.pdf?src-supplier=Element14; ComponentLink9Description: https://datasheet.ciiva.com/7746/443971-7746330.pdf?src-supplier=Element14; Supplier Part Number 1: 311-330HRCT-ND
SW1 SW2 = TL3305AF260QG: SWITCH TACTILE SPST-NO 50MA 12V; Manufacturer: E-Switch; Mechanical Life: 200000Cycles; Illumination Type: Non-Illuminated; Operating Force: 260gf; Throw Configuration: SPST; Switch Travel: 0.2mm; Switch Function: Off-Mom; Actuator Type: Standard; Designed by: ADAK; Supplier 1: Digi-Key; Manufacturer Part Number: TL3305AF260QG; RoHS: No; Category: Tactile Switches; Stock 1: 83741; Pricing 1: 1=0,21, 10=0,205, 25=0,1944, 100=0,176, 250=0,16048, 500=0,14918, 1000=0,12726 (USD); Mount: Surface Mount; Min Operating Temperature: -20°C; Max Operating Temperature: 70°C; Packaging: Cut Tape; Termination: Gull Wing; Series: TL3305; Lead Free: Lead Free; ComponentLink1URL: http://www.farnell.com/datasheets/2554191.pdf?src-supplier=Farnell; ComponentLink1Description: http://www.farnell.com/datasheets/2554191.pdf?src-supplier=Farnell; ComponentLink2URL: http://www.farnell.com/datasheets/2554191.pdf?src-supplier=Newark; ComponentLink2Description: http://www.farnell.com/datasheets/2554191.pdf?src-supplier=Newark; ComponentLink3URL: http://spec_sheets.e-switch.com/specs/P010471.pdf?src-supplier=Mouser; ComponentLink3Description: http://spec_sheets.e-switch.com/specs/P010471.pdf?src-supplier=Mouser; ComponentLink4URL: http://www.farnell.com/datasheets/2554191.pdf?src-supplier=Element14; ComponentLink4Description: http://www.farnell.com/datasheets/2554191.pdf?src-supplier=Element14; ComponentLink5URL: http://spec_sheets.e-switch.com/specs/P010471.pdf?src-supplier=Digi-Key; ComponentLink5Description: http://spec_sheets.e-switch.com/specs/P010471.pdf?src-supplier=Digi-Key; ComponentLink6URL: http://spec_sheets.e-switch.com/specs/P010471.pdf?src-supplier=NAC+Semi; ComponentLink6Description: http://spec_sheets.e-switch.com/specs/P010471.pdf?src-supplier=NAC+Semi; Supplier Part Number 1: EG5353CT-ND
U3 = STM32F107RCT6: IC MCU 32BIT 256KB FLASH 64LQFP; Manufacturer: STMicroelectronics; Max Supply Voltage: 3.6V; Frequency: 72MHz; Interface: I2C,SPI,USB,CAN,Ethernet,IrDA,UART,USART,LIN,I2S; RAM Size: 64KB; Max Power Dissipation: 444mW; Number of I/Os: 51; Number of Timers/Counters: 7; Number of PWM Channels: 16; Number of Ethernet Channels: 1; Min Supply Voltage: 2V; Data Bus Width: 32b; Oscillator Type: Internal; Number of SPI Channels: 3; Watchdog Timer: Yes; Peripherals: POR,PWM,WDT,DMA,Voltage Detect,I2C; Core Architecture: ARM; Designed by: ADAK; Supplier 1: Digi-Key; RoHS: Yes; Category: Microcontrollers; Stock 1: 1012; Pricing 1: 1=10,39, 10=9,39, 25=8,9536, 160=7,77419, 320=7,42478, 480=6,76965, 960=6,18045 (USD); Case/Package: LQFP; Number of Pins: 64; Min Operating Temperature: -40°C; Max Operating Temperature: 85°C; Package Quantity: 160; Number of ADC Channels: 16; Density: 256KB; Packaging: Tray; Number of Programmable I/O: 51; Termination: SMD/SMT; Max Frequency: 72MHz; Number of I2C Channels: 1; Memory Type: FLASH; Memory Size: 256KB; Series: STM32 F1; Length: 10mm; Width: 10mm; Height: 1.45mm; Radiation Hardening: No; Reach SVHC Compliant: No; Lead Free: Lead Free; RoHS Compliant: Yes; ComponentLink1URL: https://datasheet.ciiva.com/8054/1455641-8054992.pdf?src-supplier=Element14; ComponentLink1Description: https://datasheet.ciiva.com/8054/1455641-8054992.pdf?src-supplier=Element14; Supplier Part Number 1: 497-8914-ND; Manufacturer Part Number: STM32F107RCT6
Y1 = ECS-80-20-5PXDU-TR: CRYSTAL 8.0000MHZ 20PF SMD; Manufacturer: ECS International; Designed by: ADAK; Supplier 1: Digi-Key; Manufacturer Part Number: ECS-80-20-5PXDU-TR; RoHS: Yes; Category: Crystals; Stock 1: 109954; Pricing 1: 1=0,48, 10=0,402, 50=0,362, 100=0,3218, 500=0,30572 (USD); ComponentLink1URL: https://datasheet.ciiva.com/852/csm-7x-du-852880.pdf?src-supplier=Digi-Key; ComponentLink1Description: https://datasheet.ciiva.com/852/csm-7x-du-852880.pdf?src-supplier=Digi-Key; ComponentLink2URL: https://datasheet.ciiva.com/852/csm-7x-du-852879.pdf?src-supplier=Digi-Key; ComponentLink2Description: https://datasheet.ciiva.com/852/csm-7x-du-852879.pdf?src-supplier=Digi-Key; ComponentLink3URL: https://datasheet.ciiva.com/852/csm-7x-du-852881.pdf?src-supplier=Digi-Key; ComponentLink3Description: https://datasheet.ciiva.com/852/csm-7x-du-852881.pdf?src-supplier=Digi-Key; ComponentLink4URL: https://datasheet.ciiva.com/4946/csm-7x-du-4946102.pdf?src-supplier=Mouser; ComponentLink4Description: https://datasheet.ciiva.com/4946/csm-7x-du-4946102.pdf?src-supplier=Mouser; Supplier Part Number 1: XC1526CT-ND

## Sheet Connectors.SchDoc
size A4; SheetNumber: 3; SheetTotal: 3
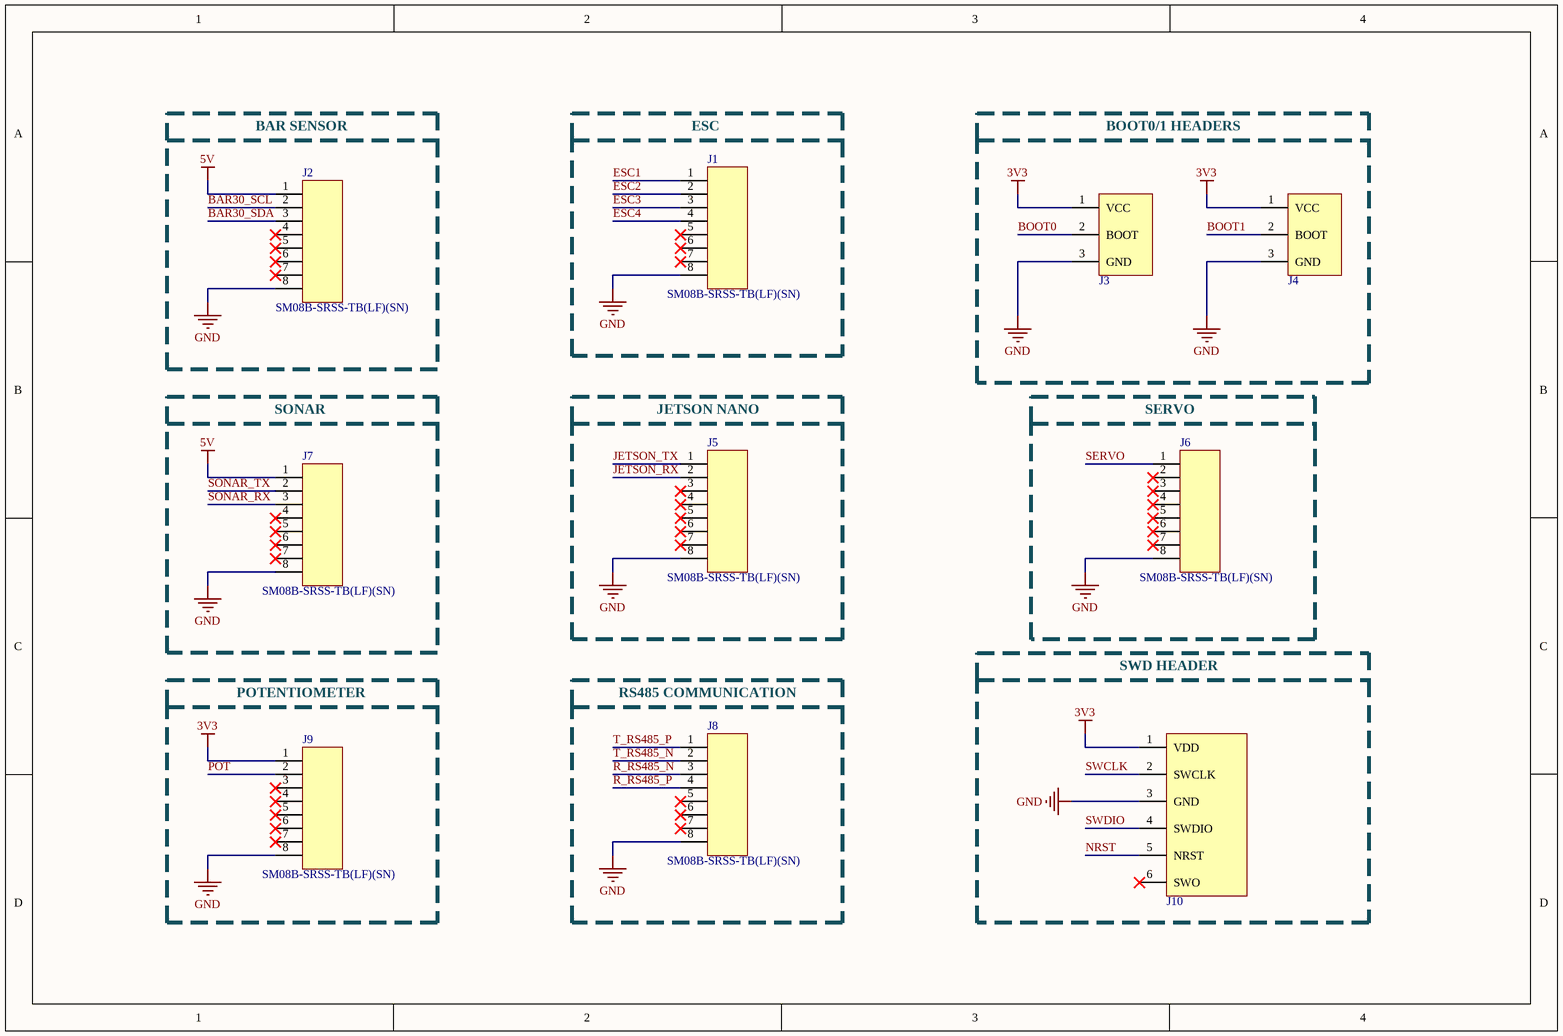
[diagram p2: Connectors.SchDoc]

### Parts
J1  SM08B-SRSS-TB(LF)(SN)  [8 PIN HEADER]
J2  SM08B-SRSS-TB(LF)(SN)  [8 PIN HEADER]
J3  61300311121  [BOOT HEADER]  (value not drawn)
J4  61300311121  [BOOT HEADER]  (value not drawn)
J5  SM08B-SRSS-TB(LF)(SN)  [8 PIN HEADER]
J6  SM08B-SRSS-TB(LF)(SN)  [8 PIN HEADER]
J7  SM08B-SRSS-TB(LF)(SN)  [8 PIN HEADER]
J8  SM08B-SRSS-TB(LF)(SN)  [8 PIN HEADER]
J9  SM08B-SRSS-TB(LF)(SN)  [8 PIN HEADER]
J10  61300611121  [SWD HEADER]  (value not drawn)

### Blocks framed on the sheet
BAR SENSOR: J2
ESC: J1
BOOT0/1 HEADERS: J3 J4
SONAR: J7
JETSON NANO: J5
SERVO: J6
POTENTIOMETER: J9
RS485 COMMUNICATION: J8
SWD HEADER: J10

### Nets
3V3: J3.1(VCC) J4.1(VCC) J9.1 J10.1(VDD)
5V: J2.1 J7.1
GND: J1.8 J2.8 J3.3(GND) J4.3(GND) J5.8 J6.8 J7.8 J8.8 J9.8 J10.3(GND)
BAR30_SCL: J2.2
BAR30_SDA: J2.3
BOOT0: J3.2(BOOT)
BOOT1: J4.2(BOOT)
ESC1: J1.1
ESC2: J1.2
ESC3: J1.3
ESC4: J1.4
JETSON_RX: J5.2
JETSON_TX: J5.1
NRST: J10.5(NRST)
POT: J9.2
R_RS485_N: J8.3
R_RS485_P: J8.4
SERVO: J6.1
SONAR_RX: J7.3
SONAR_TX: J7.2
SWCLK: J10.2(SWCLK)
SWDIO: J10.4(SWDIO)
T_RS485_N: J8.2
T_RS485_P: J8.1

Not connected (* = marked no-connect by the designer): J1 5* 6* 7*; J2 4* 5* 6* 7*; J5 3* 4* 5* 6* 7*; J6 2* 3* 4* 5* 6* 7*; J7 4* 5* 6* 7*; J8 5* 6* 7*; J9 3* 4* 5* 6* 7*; J10 6(SWO)*

### Library data of the parts
J1 J2 J5-J9 = SM08B-SRSS-TB(LF)(SN): Connector Header, Side Entry, SR Series, 8 Position, 1.00mm, 50V, Surface Mount, Tin, Natural; Manufacturer: JST; Designed by: ADAK; Supplier 1: Farnell; Manufacturer Part Number: SM08B-SRSS-TB(LF)(SN); RoHS: Yes; Category: Connectors; Stock 1: 77890; Pricing 1: 10=0,776, 100=0,639, 500=0,522, 1000=0,464, 2500=0,443, 5000=0,421 (EUR); ComponentLink1URL: https://datasheet.ciiva.com/11752/0900766b8082f54b-11752174.pdf?src-supplier=Rs; ComponentLink1Description: https://datasheet.ciiva.com/11752/0900766b8082f54b-11752174.pdf?src-supplier=Rs; ComponentLink2URL: https://datasheet.ciiva.com/8052/91630-8052285.pdf?src-supplier=Element14; ComponentLink2Description: https://datasheet.ciiva.com/8052/91630-8052285.pdf?src-supplier=Element14; ComponentLink3URL: https://datasheet.ciiva.com/729/esr-729838.pdf?src-supplier=Digi-Key; ComponentLink3Description: https://datasheet.ciiva.com/729/esr-729838.pdf?src-supplier=Digi-Key; ComponentLink4URL: https://datasheet.ciiva.com/712/esr-712599.pdf?src-supplier=Digi-Key; ComponentLink4Description: https://datasheet.ciiva.com/712/esr-712599.pdf?src-supplier=Digi-Key; ComponentLink5URL: https://datasheet.ciiva.com/712/esr-712600.pdf?src-supplier=Digi-Key; ComponentLink5Description: https://datasheet.ciiva.com/712/esr-712600.pdf?src-supplier=Digi-Key; ComponentLink6URL: https://datasheet.ciiva.com/16487/esr-16487087.pdf?src-supplier=Future+Electronics; ComponentLink6Description: https://datasheet.ciiva.com/16487/esr-16487087.pdf?src-supplier=Future+Electronics; Supplier Part Number 1: 1679124
J3 J4 = 61300311121: CONN HEADER VERT 3POS 2.54MM; Manufacturer: Wurth Electronics; Number of Positions: 3; Gender: Male; Pitch: 0.1inch; Designed by: ADAK; Supplier 1: Digi-Key; Manufacturer Part Number: 61300311121; RoHS: Yes; Category: Connectors; Stock 1: 116212; Pricing 1: 1=0,13, 10=0,113, 25=0,094, 50=0,079, 100=0,071, 1000=0,066 (USD); Mount: Through Hole; Contact Plating: Gold; Contact Material: Copper; Color: Black; Number of Rows: 1; Packaging: Bulk; Termination: Solder; Number of Contacts: 3; Series: WR-PHD; Contact Type: Male Pin; Contact Mating Length: 0.236inch; Lead Free: Lead Free; RoHS Compliant: Yes; Reach SVHC Compliant: Unknown; ComponentLink1URL: http://www.farnell.com/cad/1737268.pdf?src-supplier=Element14; ComponentLink1Description: http://www.farnell.com/cad/1737268.pdf?src-supplier=Element14; ComponentLink2URL: https://datasheet.octopart.com/61300311121-W%C3%BCrth-Elektronik-datasheet-21154836.pdf?src-supplier=Element14; ComponentLink2Description: https://datasheet.octopart.com/61300311121-W%C3%BCrth-Elektronik-datasheet-21154836.pdf?src-supplier=Element14; ComponentLink3URL: https://katalog.we-online.de/em/datasheet/6130xx11121.pdf?src-supplier=Digi-Key; ComponentLink3Description: https://katalog.we-online.de/em/datasheet/6130xx11121.pdf?src-supplier=Digi-Key; Supplier Part Number 1: 732-5316-ND
J10 = 61300611121: CONN HEADER VERT 6POS 2.54MM; Manufacturer: Wurth Electronics; Current Rating: 3A; Voltage Rating: 250V; Number of Positions: 6; Gender: Male; Pitch: 0.1inch; Designed by: ADAK; Supplier 1: Digi-Key; Manufacturer Part Number: 61300611121; RoHS: Yes; Category: Headers and Wire Housings; Stock 1: 10537; Pricing 1: 1=0,35, 10=0,298, 25=0,2472, 50=0,207, 100=0,187, 1000=0,171 (USD); Mount: Through Hole; Contact Plating: Gold; Contact Material: Copper Alloy,Copper; Housing Material: PBT; Color: Black; Min Operating Temperature: -40°C; Max Operating Temperature: 125°C; Number of Rows: 1; Contact Gender: Male; Packaging: Bulk; Termination: Through Hole; Number of Contacts: 6; Series: WR-PHD; Contact Type: Male Pin; Contact Mating Length: 0.236inch; Lead Free: Lead Free; RoHS Compliant: Yes; Reach SVHC Compliant: Unknown; ComponentLink1URL: http://www.mouser.com/ds/2/445/6130xx11121-538006.pdf?src-supplier=Mouser; ComponentLink1Description: http://www.mouser.com/ds/2/445/6130xx11121-538006.pdf?src-supplier=Mouser; ComponentLink2URL: http://www.farnell.com/cad/1737268.pdf?src-supplier=Element14; ComponentLink2Description: http://www.farnell.com/cad/1737268.pdf?src-supplier=Element14; ComponentLink3URL: https://datasheet.octopart.com/61300611121-W%C3%BCrth-Elektronik-datasheet-21154836.pdf?src-supplier=Element14; ComponentLink3Description: https://datasheet.octopart.com/61300611121-W%C3%BCrth-Elektronik-datasheet-21154836.pdf?src-supplier=Element14; ComponentLink4URL: https://katalog.we-online.de/em/datasheet/6130xx11121.pdf?src-supplier=Digi-Key; ComponentLink4Description: https://katalog.we-online.de/em/datasheet/6130xx11121.pdf?src-supplier=Digi-Key; Supplier Part Number 1: 732-5319-ND

## Nets that join several sheets
3V3: PowerManagement (9 pins), Microcontroller (15 pins), Connectors (J3.1 J4.1 J9.1 J10.1)
5V: PowerManagement (5 pins), Connectors (J2.1 J7.1)
GND: PowerManagement (16 pins), Microcontroller (21 pins), Connectors (10 pins)
BAR30_SCL: Microcontroller (U3.58), Connectors (J2.2)
BAR30_SDA: Microcontroller (U3.59), Connectors (J2.3)
BOOT0: Microcontroller (U3.60), Connectors (J3.2)
BOOT1: Microcontroller (U3.28), Connectors (J4.2)
ESC1: Microcontroller (U3.37), Connectors (J1.1)
ESC2: Microcontroller (U3.38), Connectors (J1.2)
ESC3: Microcontroller (U3.39), Connectors (J1.3)
ESC4: Microcontroller (U3.40), Connectors (J1.4)
JETSON_RX: Microcontroller (U3.43), Connectors (J5.2)
JETSON_TX: Microcontroller (U3.42), Connectors (J5.1)
NRST: Microcontroller (5 pins), Connectors (J10.5)
POT: Microcontroller (U3.20), Connectors (J9.2)
R_RS485_N: PowerManagement (R5.2 U2.11), Connectors (J8.3)
R_RS485_P: PowerManagement (R5.1 U2.12), Connectors (J8.4)
RS485_RX: PowerManagement (R3.1 U2.2), Microcontroller (U3.52)
RS485_RX_EN: PowerManagement (R4.1 U2.3), Microcontroller (U3.62)
RS485_TX: PowerManagement (U2.5), Microcontroller (U3.51)
RS485_TX_EN: PowerManagement (R6.1 U2.4), Microcontroller (U3.61)
SERVO: Microcontroller (U3.44), Connectors (J6.1)
SONAR_RX: Microcontroller (U3.30), Connectors (J7.3)
SONAR_TX: Microcontroller (U3.29), Connectors (J7.2)
SWCLK: Microcontroller (U3.49), Connectors (J10.2)
SWDIO: Microcontroller (U3.46), Connectors (J10.4)
T_RS485_N: PowerManagement (R7.2 U2.10), Connectors (J8.2)
T_RS485_P: PowerManagement (R7.1 U2.9), Connectors (J8.1)